# Altium project CoinSensor _LMV321 v1.0.PrjPcb
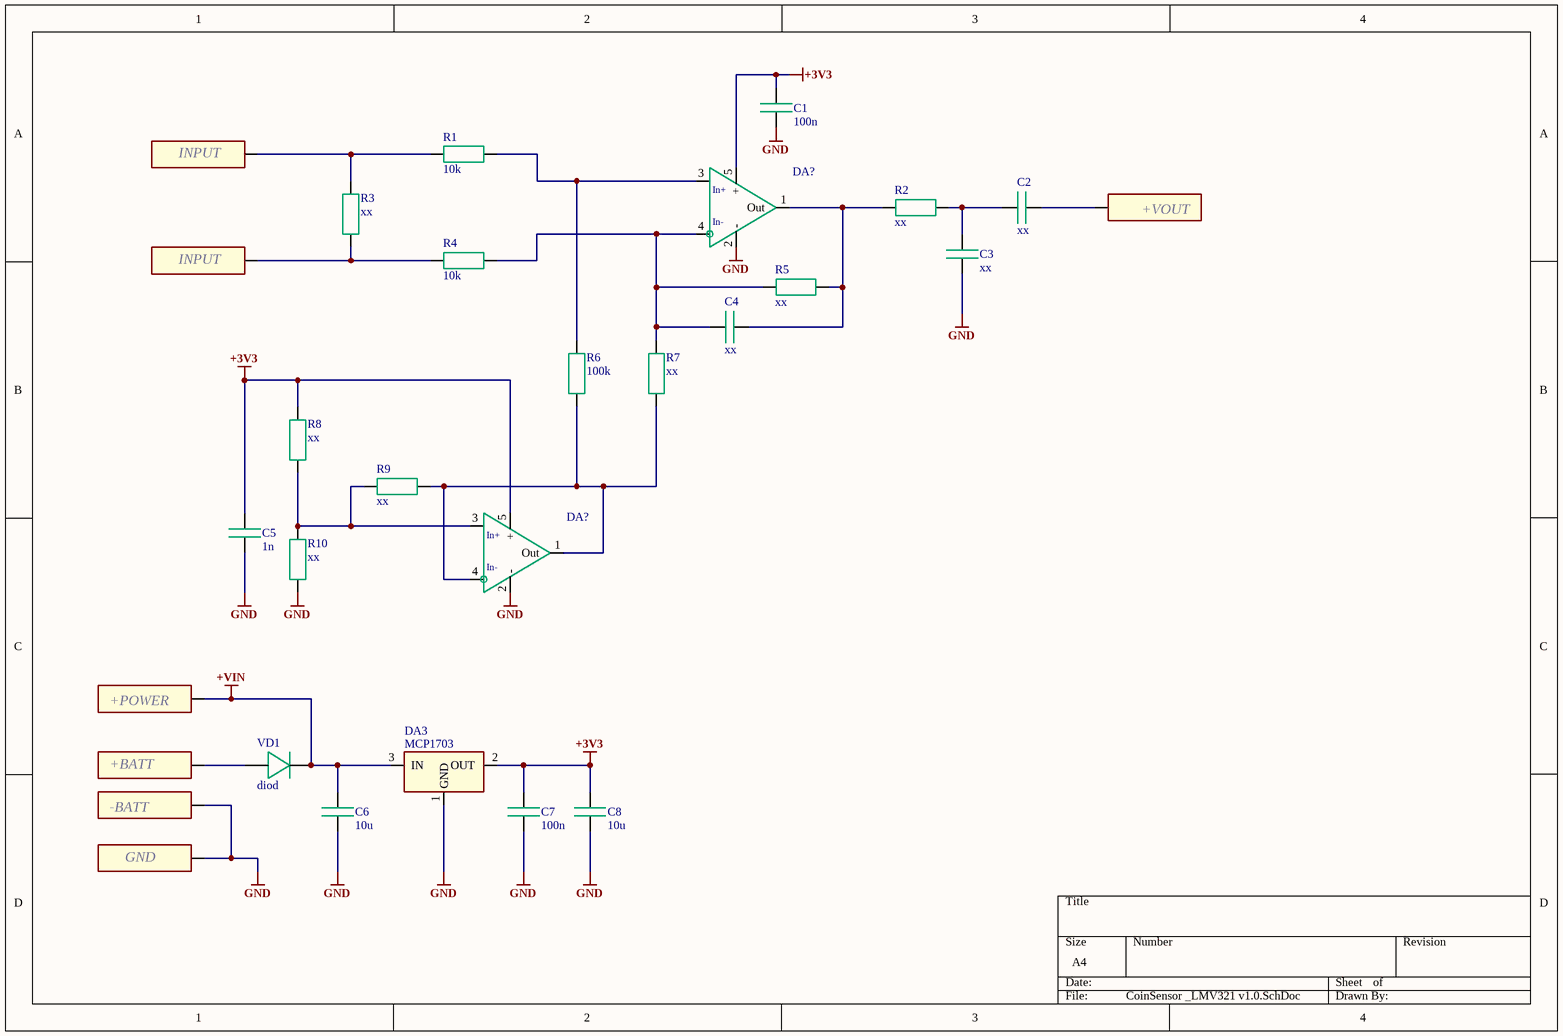
[diagram p0: CoinSensor _LMV321 v1.0.SchDoc]
1 sheet, 29 parts. Net scope: global (net labels, ports and power ports of the same name join across sheets).
Board file: CoinSensor _LMV321 v1.0.PcbDoc

## Sheet CoinSensor _LMV321 v1.0.SchDoc
size A4

### Parts
(Parts that share a designator on the sheet are numbered #1, #2 ... from top to bottom, then left to right.)
C1  100n  [CAP 0603]
C2  xx  [CAP 0603]
C3  xx  [CAP 0603]
C4  xx  [CAP 0603]
C5  1n  [CAP 0603]
C6  10u  [CAP 0603]
C7  100n  [CAP 0603]
C8  10u  [CAP 0603]
DA3  MCP1703  [SOT-23A]
DA?#1  TLV333IDBVR  [SOT-23-5]  (value not drawn)
DA?#2  TLV333IDBVR  [SOT-23-5]  (value not drawn)
R1  10k  [RES 0603]
R2  xx  [RES 0603]
R3  xx  [RES 0603]
R4  10k  [RES 0603]
R5  xx  [RES 0603]
R6  100k  [RES 0603]
R7  xx  [RES 0603]
R8  xx  [RES 0603]
R9  xx  [RES 0603]
R10  xx  [RES 0603]
VD1  diod  [SOD-323]
X1  INPUT  [PLS-1]  (no BOM)
X2  +VOUT  [PLS-1]  (no BOM)
X3  INPUT  [PLS-1]  (no BOM)
X4  Name: +POWER  [PLS-1]  (hidden comment: +VIN)  (no BOM)
X5  +BATT  [PLS-1]  (no BOM)
X6  -BATT  [PLS-1]  (no BOM)
X7  GND  [PLS-1]  (no BOM)

### Nets
+3V3: C1.2 C5.2 C7.2 C8.2 DA3.2(OUT) DA?#1.5(+) DA?#2.5(+) R8.1
+VIN: C6.2 DA3.3(IN) VD1.1 X4.1
GND: C1.1 C3.2 C5.1 C6.1 C7.1 C8.1 DA3.1(GND) DA?#1.2(-) DA?#2.2(-) R10.2 X6.1 X7.1
NetC2_1: C2.1 C3.1 R2.1
NetC2_2: C2.2 X2.1
NetC4_1: C4.1 DA?#1.4 R4.1 R5.1 R7.2
NetC4_2: C4.2 DA?#1.1(Out) R2.2 R5.2
NetDA?#1_3: DA?#1.3 R1.1 R6.2
NetDA?#2_1: DA?#2.1(Out) DA?#2.4 R6.1 R7.1 R9.2
NetDA?#2_3: DA?#2.3 R8.2 R9.1 R10.1
NetR1_2: R1.2 R3.1 X1.1
NetR3_2: R3.2 R4.2 X3.1
NetVD1_2: VD1.2 X5.1

### Notes on the sheet
- (in symbol TLV333IDBVR) In+; In-

### Library data of the parts
C1 C7 = Cap 0603: Ceramic capacitor, SMD; Manufacturer: Samsung; Manufacturer P/N: C14663; Tolerance: ±10%; Корпус: 0603; Комментарий: Конденсатор керамический, SMD; ID: Cap 0603; Type: Capacitor; Temperature: -55…+125; HelpURL: pdf/passive/samsung-chip-cap.pdf
C2-C4 = Cap 0603: Ceramic capacitor, SMD; Manufacturer: Samsung; Manufacturer P/N: CL10B___K_; Tolerance: ±10%; Корпус: 0603; Комментарий: Конденсатор керамический, SMD; ID: Cap 0603; Type: Capacitor; Temperature: -55…+125; HelpURL: pdf/passive/samsung-chip-cap.pdf
C5 = Cap 0603: Ceramic capacitor, SMD; Manufacturer: Samsung; Manufacturer P/N: C1588; Tolerance: ±10%; Корпус: 0603; Комментарий: Конденсатор керамический, SMD; ID: Cap 0603; Type: Capacitor; Temperature: -55…+125; HelpURL: pdf/passive/samsung-chip-cap.pdf
C6 C8 = Cap 0603: Ceramic capacitor, SMD; Manufacturer: Samsung; Manufacturer P/N: C19702; Tolerance: ±10%; Корпус: 0603; Комментарий: Конденсатор керамический, SMD; ID: Cap 0603; Type: Capacitor; Temperature: -55…+125; HelpURL: pdf/passive/samsung-chip-cap.pdf
DA3 = MCP1703: Voltage regulator, linear; Manufacturer: Microchip; Manufacturer P/N: C39051; Vcc min: 2.7V; Vcc max: 16V; Iout max: 0.25A; Корпус: SOT-23; Комментарий: Линейный стабилизатор; ID: MCP1703; Type: linear regulator; Temperature: -40…+125; HelpURL: pdf/ica/MCP1703.pdf
DA?#1 DA?#2 = TLV333IDBVR: Operation Amplifier, rail-to-rail; Manufacturer: Texas Instruments; Vcc min: 1.8V; Vcc max: 5.5V; Freq max: 350kHz; Комментарий: ОУ общего назначения, rail-to-rail вход-выход; ID: TLV333IDBVR; Type: OpAmp; Temperature: -40…+125; Manufacturer P/N: TLV333IDBVR; Digikey p/n: 296-43777-1-ND; Корпус: SOT-23-5
R1-R10 = Res 0603: Chip resistor, SMD; Manufacturer: Samsung; Tolerance: 5%; Power: 0.1W; Max Voltage: 50V; Корпус: 0603; Комментарий: Резистор постоянный, SMD; ID: Res 0603; Type: Resistor; Temperature: -55…+155; HelpURL: pdf/passive/Samsung-RC3216J101CS.pdf; ComponentLink1URL: pdf/passive/Samsung-RC3216J101CS.pdf; ComponentLink1Description: Samsung Datasheet
VD1 = RB751V40T1G: Diode schottky; Manufacturer: ON Semiconductor; Manufacturer P/N: C191023; Voltage: 30V; Voltage max: 40V; Комментарий: Диод Шоттки; ID: RB751V40T1G; Type: diod; HelpURL: pdf/discrete/RB751V40T1G.pdf; Digikey p/n: RB751V40T1GOSCT-ND; Корпус: SOD-323
X1-X7 = IN-OUT pin: Manufacturer: KHADB; ID: IN-OUT pin
  X1 X3: Name: INPUT
  X2: Name: +VOUT
  X5: Name: +BATT
  X6: Name: -BATT
  X7: Name: GND

## Assembly variants
MAIN variant: not fitted C14 C15 C19 C20 C21 DA3 Q1 R7 R9 R11 R17